# EAGLE design outin_shield_pi_bplus (EAGLE 7.4.0)
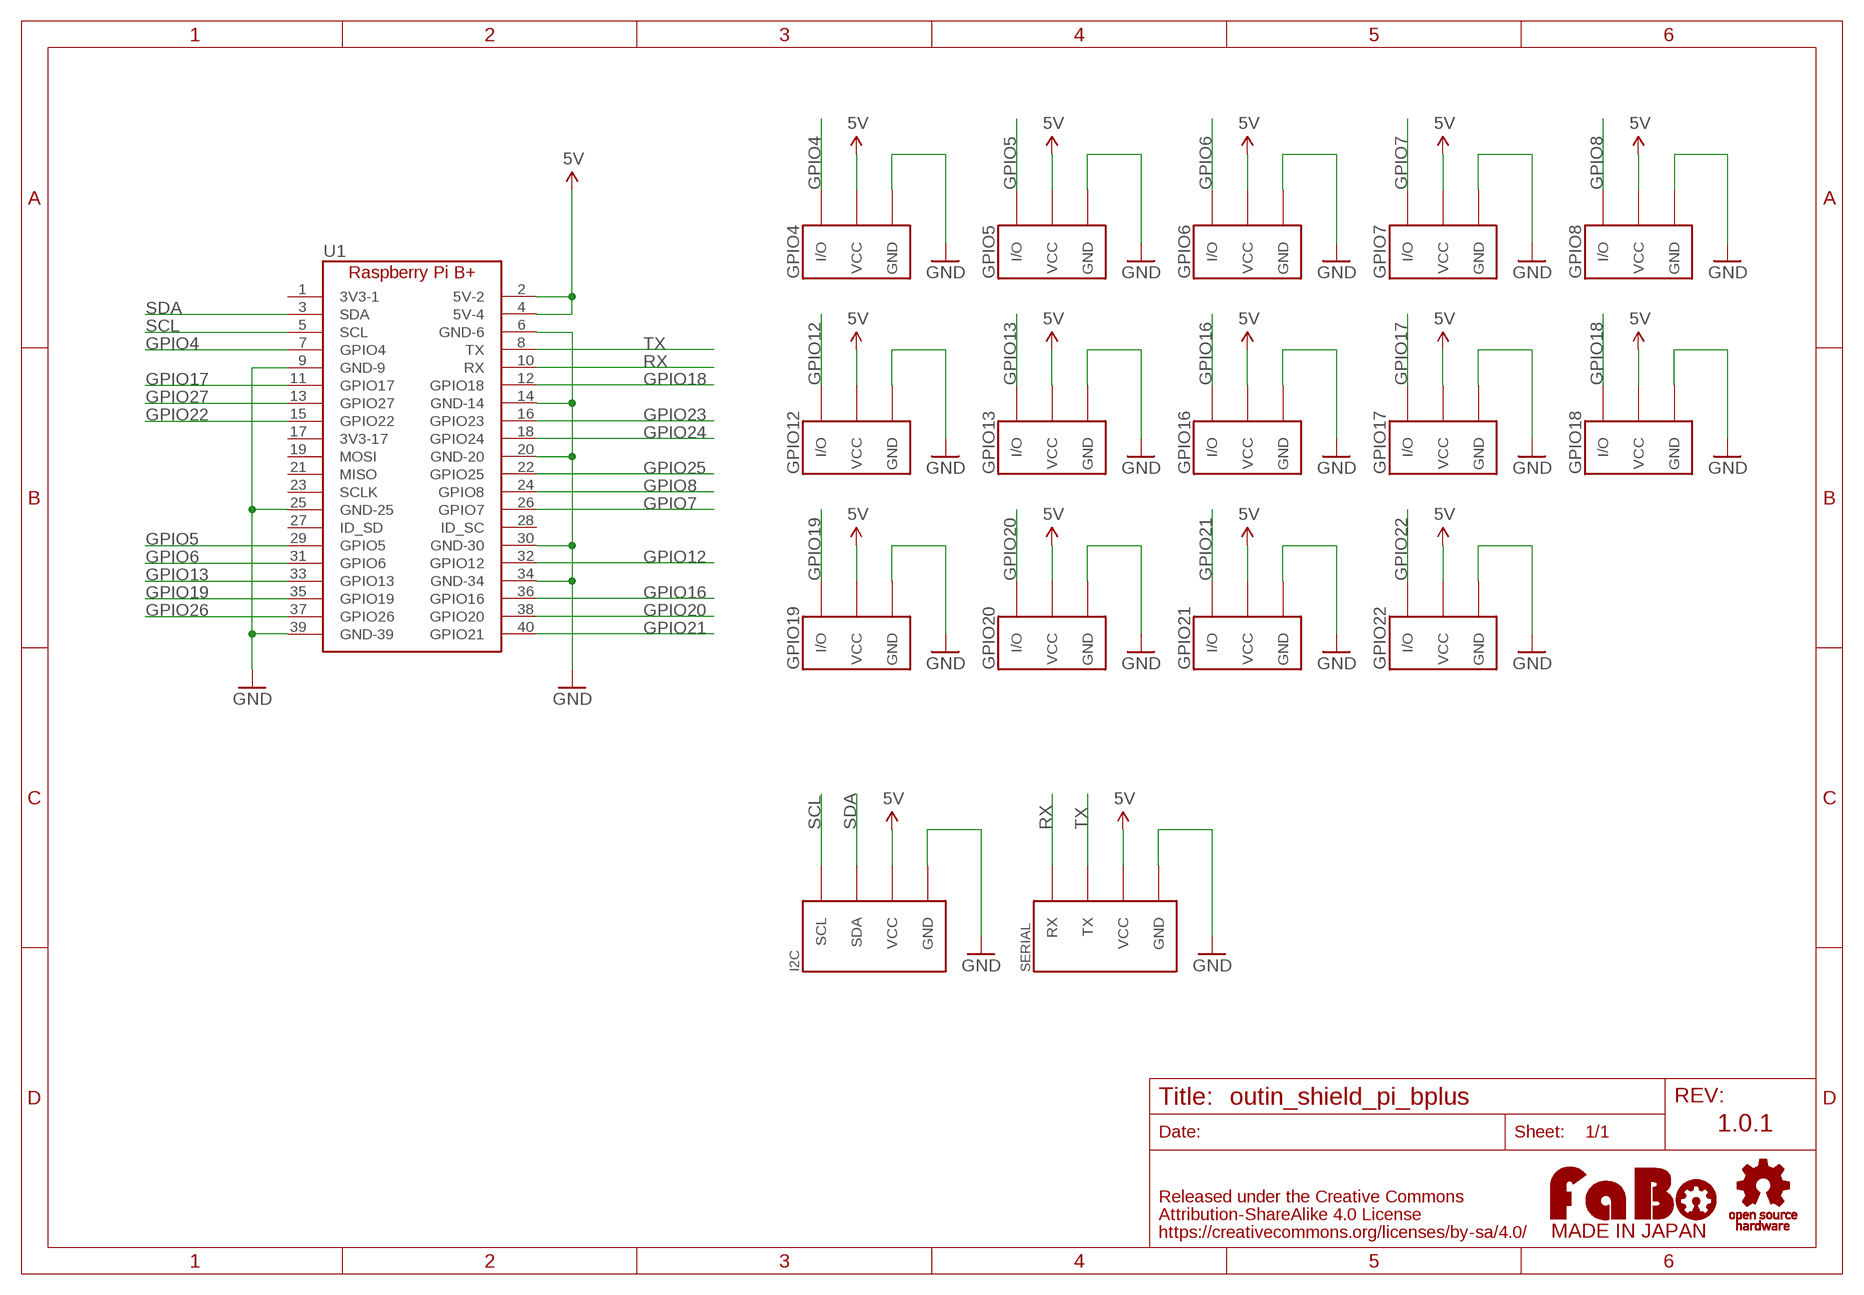
[diagram p0: schematic, sheet 1]

## Parts
GPIO4  FABO_BRICK_3PIN-HEADER  [FABO_BRICK_3PIN_HEADER]
GPIO5  FABO_BRICK_3PIN-HEADER  [FABO_BRICK_3PIN_HEADER]
GPIO6  FABO_BRICK_3PIN-HEADER  [FABO_BRICK_3PIN_HEADER]
GPIO7  FABO_BRICK_3PIN-HEADER  [FABO_BRICK_3PIN_HEADER]
GPIO8  FABO_BRICK_3PIN-HEADER  [FABO_BRICK_3PIN_HEADER]
GPIO12  FABO_BRICK_3PIN-HEADER  [FABO_BRICK_3PIN_HEADER]
GPIO13  FABO_BRICK_3PIN-HEADER  [FABO_BRICK_3PIN_HEADER]
GPIO16  FABO_BRICK_3PIN-HEADER  [FABO_BRICK_3PIN_HEADER]
GPIO17  FABO_BRICK_3PIN-HEADER  [FABO_BRICK_3PIN_HEADER]
GPIO18  FABO_BRICK_3PIN-HEADER  [FABO_BRICK_3PIN_HEADER]
GPIO19  FABO_BRICK_3PIN-HEADER  [FABO_BRICK_3PIN_HEADER]
GPIO20  FABO_BRICK_3PIN-HEADER  [FABO_BRICK_3PIN_HEADER]
GPIO21  FABO_BRICK_3PIN-HEADER  [FABO_BRICK_3PIN_HEADER]
GPIO22  FABO_BRICK_3PIN-HEADER  [FABO_BRICK_3PIN_HEADER]
I2C  FABO_BRICK_I2C-CONNECTOR  [FABO_BRICK_I2C_CONNECTOR]
SERIAL  FABO_BRICK_SERIAL-CONNECTOR  [FABO_BRICK_SERIAL_CONNECTOR]
U1  RASPBERRY_PI_B+  [RASPBERRY_PI_B+]
U$4  LOGO_OSHW-T_M  [LOGO_OSHW_T_M]
U$14  LOGO_FABO-M  [LOGO_FABO_M]

## Nets
5V: GPIO4.VCC GPIO5.VCC GPIO6.VCC GPIO7.VCC GPIO8.VCC GPIO12.VCC GPIO13.VCC GPIO16.VCC GPIO17.VCC GPIO18.VCC GPIO19.VCC GPIO20.VCC GPIO21.VCC GPIO22.VCC I2C.VCC SERIAL.VCC U1.2(5V-2) U1.4(5V-4)
GND: GPIO4.GND GPIO5.GND GPIO6.GND GPIO7.GND GPIO8.GND GPIO12.GND GPIO13.GND GPIO16.GND GPIO17.GND GPIO18.GND GPIO19.GND GPIO20.GND GPIO21.GND GPIO22.GND I2C.GND SERIAL.GND U1.6(GND-6) U1.9(GND-9) U1.14(GND-14) U1.20(GND-20) U1.25(GND-25) U1.30(GND-30) U1.34(GND-34) U1.39(GND-39)
GPIO4: GPIO4.I/O U1.7(GPIO4)
GPIO5: GPIO5.I/O U1.29(GPIO5)
GPIO6: GPIO6.I/O U1.31(GPIO6)
GPIO7: GPIO7.I/O U1.26(GPIO7)
GPIO8: GPIO8.I/O U1.24(GPIO8)
GPIO12: GPIO12.I/O U1.32(GPIO12)
GPIO13: GPIO13.I/O U1.33(GPIO13)
GPIO16: GPIO16.I/O U1.36(GPIO16)
GPIO17: GPIO17.I/O U1.11(GPIO17)
GPIO18: GPIO18.I/O U1.12(GPIO18)
GPIO19: GPIO19.I/O U1.35(GPIO19)
GPIO20: GPIO20.I/O U1.38(GPIO20)
GPIO21: GPIO21.I/O U1.40(GPIO21)
GPIO22: GPIO22.I/O U1.15(GPIO22)
GPIO23: U1.16(GPIO23)
GPIO24: U1.18(GPIO24)
GPIO25: U1.22(GPIO25)
GPIO26: U1.37(GPIO26)
GPIO27: U1.13(GPIO27)
RX: SERIAL.RX U1.10(RX)
SCL: I2C.SCL U1.5(SCL)
SDA: I2C.SDA U1.3(SDA)
TX: SERIAL.TX U1.8(TX)
Unconnected: U1.1(3V3-1) U1.17(3V3-17) U1.19(MOSI) U1.21(MISO) U1.23(SCLK) U1.27(ID_SD) U1.28(ID_SC)

## Notes on the sheet
- 1.0.1

## Library data of the parts
GPIO4-GPIO8 GPIO12 GPIO13 GPIO16-GPIO22 = FaBo-Template:FABO_BRICK_3PIN: FaBo Brick 3pin
I2C = FaBo-Template:FABO_BRICK_I2C: FaBo Brick I2C
SERIAL = FaBo-Template:FABO_BRICK_SERIAL: FaBo Brick Serial
U1 = FaBo-Boards:RASPBERRY_PI_B+
U$4 = FaBo-etc:LOGO_OSHW
U$14 = FaBo-etc:LOGO_FABO

## Board
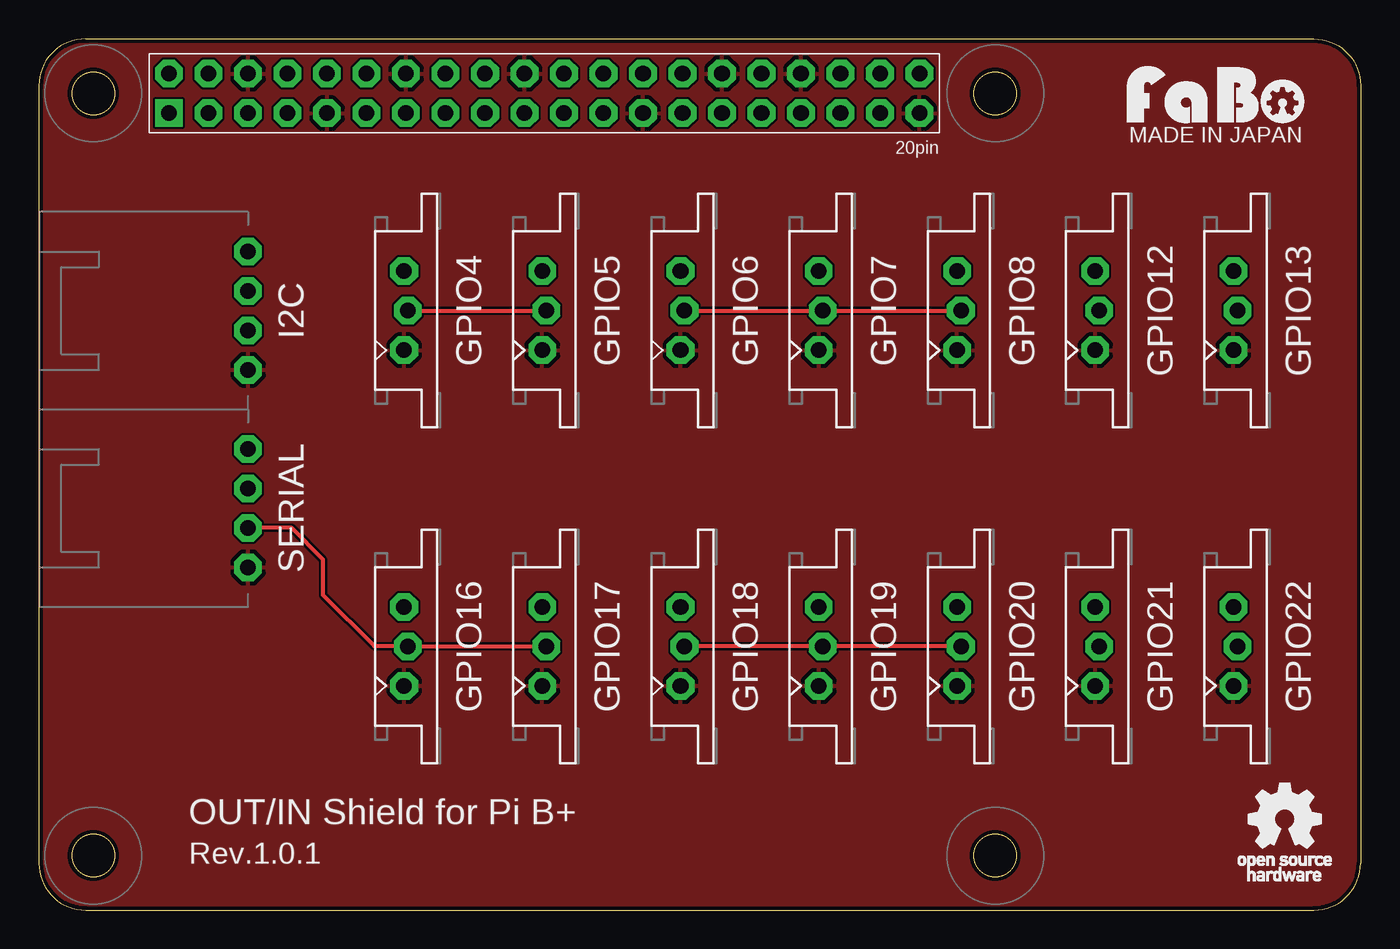
[diagram p1: board, top side]
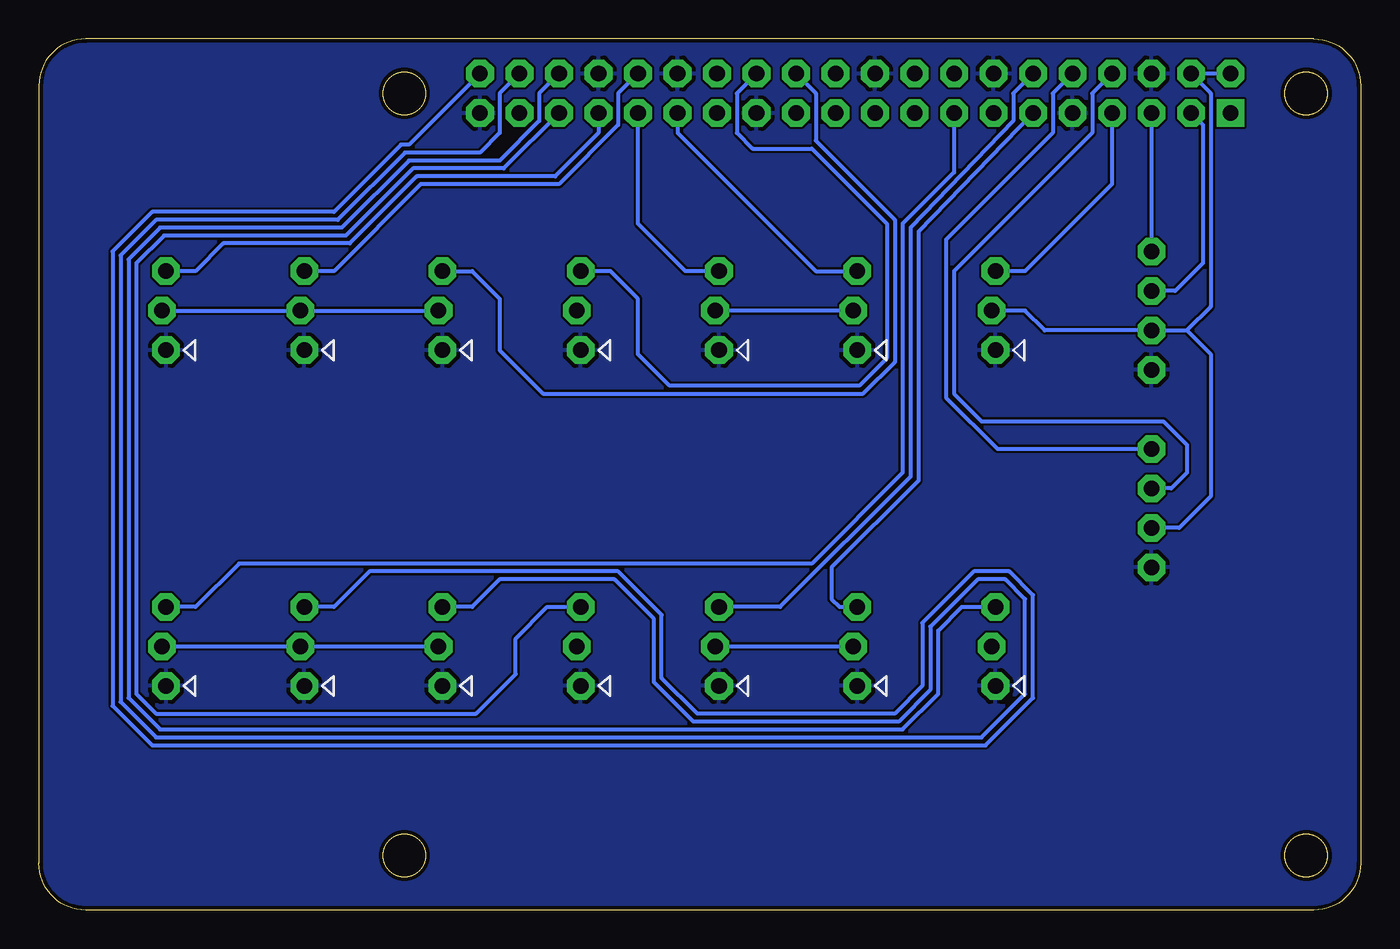
[diagram p2: board, bottom side, seen from below]

Size 85 x 56 mm. Coordinates in mm from the lower left corner, seen from the top.
Copper layers (1*16): Top 0.035mm / dielectric 1.5mm / Bottom 0.035mm
Design rules "Elecrow_2-layer_eagle_rule": minimum track width 6mil, minimum drill 12mil, track to track 6mil, track to pad 6mil, pad to pad 6mil, via to via 6mil, smd to smd 0mil, copper to edge 10mil, drill to drill 10mil, minimum pad ring 10mil, minimum via ring 6mil, stop-mask expansion 2mil, vias tented up to drill 100mil, thermal gap 10mil

### Footprints (pad centres in the part's own frame; a part is rotated, then mirrored left to right if it is on the bottom)
FABO_BRICK_3PIN_HEADER = drill 1 pad 1.778 octagon: GND -2.54,0.127; I/O 2.54,0.127; VCC 0,-0.127
FABO_BRICK_I2C_CONNECTOR = drill 1 pad 1.778 octagon: GND -3.81,0; SCL 3.81,0; SDA 1.27,0; VCC -1.27,0
FABO_BRICK_SERIAL_CONNECTOR = drill 1 pad 1.778 octagon: GND -3.81,0; RX 3.81,0; TX 1.27,0; VCC -1.27,0
RASPBERRY_PI_B+ = drill 1 pad 1.778 square: 1 0,-2.54 | drill 1 pad 1.778 octagon: 2 0,0; 3 2.54,-2.54; 4 2.54,0; 5 5.08,-2.54; 6 5.08,0; 7 7.62,-2.54; 8 7.62,0; 9 10.16,-2.54; 10 10.16,0; 11 12.7,-2.54; 12 12.7,0; 13 15.24,-2.54; 14 15.24,0; 15 17.78,-2.54; 16 17.78,0; 17 20.32,-2.54; 18 20.32,0; 19 22.86,-2.54; 20 22.86,0; 21 25.4,-2.54; 22 25.4,0; 23 27.94,-2.54; 24 27.94,0; 25 30.48,-2.54; 26 30.48,0; 27 33.02,-2.54; 28 33.02,0; 29 35.56,-2.54; 30 35.56,0; 31 38.1,-2.54; 32 38.1,0; 33 40.64,-2.54; 34 40.64,0; 35 43.18,-2.54; 36 43.18,0; 37 45.72,-2.54; 38 45.72,0; 39 48.26,-2.54; 40 48.26,0

### Placement (x,y rotation side)
GPIO4  23.61,38.53 90 top
GPIO5  32.5,38.53 90 top
GPIO6  41.39,38.53 90 top
GPIO7  50.28,38.53 90 top
GPIO8  59.17,38.53 90 top
GPIO12  68.06,38.53 90 top
GPIO13  76.95,38.53 90 top
GPIO16  23.61,16.94 90 top
GPIO17  32.5,16.94 90 top
GPIO18  41.39,16.94 90 top
GPIO19  50.28,16.94 90 top
GPIO20  59.17,16.94 90 top
GPIO21  68.06,16.94 90 top
GPIO22  76.95,16.94 90 top
I2C  13.45,38.53 90 top
SERIAL  13.45,25.83 90 top
U1  8.37,53.77 0 top
U$4  80.12,5.83 0 top
U$14  75.68,50.6 0 top

### Tracks (layer width: path | path; a pad name or v marks a point on that pad's centre or on a via)
5V
  Top 0.254: GPIO4.VCC GPIO5.VCC | GPIO6.VCC GPIO7.VCC GPIO8.VCC | GPIO20.VCC GPIO19.VCC GPIO18.VCC | SERIAL.VCC 16.24,24.56 18.28,22.53 18.28,20.24 21.58,16.94 GPIO16.VCC GPIO17.VCC
  Bottom 0.254: 11.16,37.26 9.64,38.78 9.64,52.5 U1.4 U1.2 | 11.16,37.26 I2C.VCC 20.31,37.26 21.58,38.53 GPIO4.VCC | 11.16,37.26 9.64,35.74 9.64,26.59 11.67,24.56 SERIAL.VCC | GPIO13.VCC GPIO12.VCC GPIO8.VCC | GPIO5.VCC GPIO6.VCC | GPIO22.VCC GPIO21.VCC GPIO20.VCC | GPIO18.VCC GPIO17.VCC
GND
  pour Bottom: -1.79,-2.11 87.11,-2.11 87.11,57.58 -1.79,57.58
  pour Top: -1.79,-2.11 87.11,-2.11 87.11,57.58 -1.79,57.58
GPIO4
  Bottom 0.254: U1.7 15.99,46.66 21.58,41.07 GPIO4.I/O
GPIO5
  Bottom 0.254: U1.29 43.93,49.96 35.04,41.07 GPIO5.I/O
GPIO6
  Bottom 0.254: GPIO6.I/O 43.42,41.07 46.47,44.12 U1.31
GPIO7
  Bottom 0.254: U1.26 40.12,52.5 40.12,49.96 39.1,48.94 35.29,48.94 30.47,44.12 30.47,35.48 32.25,33.7 44.44,33.7 46.47,35.74 46.47,39.29 48.25,41.07 GPIO7.I/O
GPIO8
  Bottom 0.254: U1.24 35.04,52.5 35.04,49.45 29.96,44.37 29.96,35.23 31.99,33.2 52.57,33.2 55.36,35.99 55.36,39.29 57.14,41.07 GPIO8.I/O
GPIO12
  Bottom 0.254: U1.32 47.74,52.5 47.74,50.47 51.55,46.66 60.44,46.66 66.03,41.07 GPIO12.I/O
GPIO13
  Bottom 0.254: U1.33 49.01,49.96 51.8,47.17 60.69,47.17 65.01,42.85 73.14,42.85 74.92,41.07 GPIO13.I/O
GPIO16
  Bottom 0.254: U1.36 52.82,52.5 52.82,50.72 55.36,48.18 61.2,48.18 65.52,43.86 77.2,43.86 79.24,41.83 79.24,13.64 77.2,11.61 29.45,11.61 27.17,13.89 27.17,17.96 25.64,19.48 GPIO16.I/O
GPIO17
  Bottom 0.254: U1.11 28.44,43.61 28.44,27.61 34.02,22.02 34.02,19.99 33.52,19.48 GPIO17.I/O
GPIO18
  Bottom 0.254: U1.12 22.34,52.5 22.34,50.72 28.94,43.86 28.94,27.86 37.33,19.48 GPIO18.I/O
GPIO19
  Bottom 0.254: U1.35 55.11,47.67 60.95,47.67 65.27,43.36 76.95,43.36 78.73,41.58 78.73,13.89 77.46,12.62 56.88,12.62 54.34,15.16 54.34,17.45 52.31,19.48 GPIO19.I/O
GPIO20
  Bottom 0.254: U1.38 55.36,52.5 55.36,49.96 56.63,48.69 61.46,48.69 65.77,44.37 77.46,44.37 79.74,42.09 79.74,13.38 77.46,11.1 24.37,11.1 21.58,13.89 21.58,19.99 22.85,21.26 24.63,21.26 27.67,18.21 27.67,14.15 29.71,12.11 42.91,12.11 45.45,14.65 45.45,18.72 47.99,21.26 55.36,21.26 57.14,19.48 GPIO20.I/O
GPIO21
  Bottom 0.254: U1.40 61.2,49.2 61.71,49.2 66.03,44.88 77.71,44.88 80.25,42.34 80.25,13.13 77.71,10.59 24.12,10.59 21.07,13.64 21.07,20.24 22.59,21.77 24.88,21.77 28.18,18.46 28.18,14.4 29.96,12.62 42.66,12.62 44.95,14.91 44.95,18.97 47.74,21.77 63.74,21.77 66.03,19.48 GPIO21.I/O
GPIO22
  Bottom 0.254: U1.15 26.15,47.42 29.45,44.12 29.45,28.12 35.29,22.27 72.12,22.27 74.92,19.48 GPIO22.I/O
RX
  Bottom 0.254: U1.10 19.8,52.5 19.8,49.96 26.66,43.1 26.66,32.94 23.36,29.64 SERIAL.RX
SCL
  Bottom 0.254: U1.5 I2C.SCL
SDA
  Bottom 0.254: U1.3 10.15,50.47 10.15,41.58 11.93,39.8 I2C.SDA
TX
  Bottom 0.254: U1.8 17.26,52.5 17.26,49.96 26.15,41.07 26.15,33.2 24.37,31.42 12.69,31.42 11.16,29.89 11.16,28.12 12.18,27.1 SERIAL.TX

### Text on the board
tPlace: 20pin | MADE IN JAPAN | OUT/IN Shield for Pi B+ | Rev.1.0.1